# Altium schematic sheet images.SchDoc
size A4; SheetNumber: 3; SheetTotal: 3
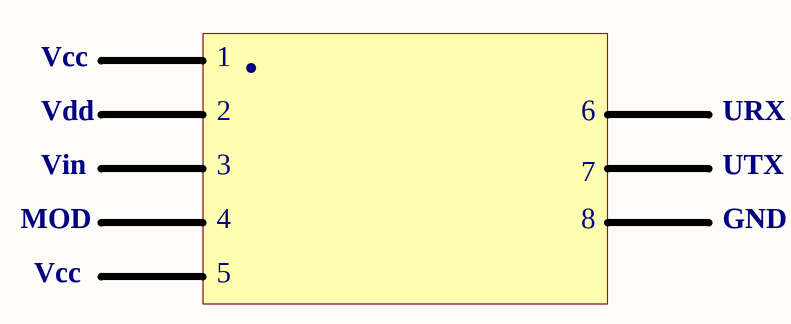
[diagram p0: images.SchDoc]

## Notes on the sheet
- Vcc
- Vdd
- 1
- 2
- .
- 6
- URX
- Vin
- 3
- 7
- UTX
- MOD
- 4
- 8
- GND
- 5